# Altium schematic sheet SIM7600G-H_PWR_CTRL.SchDoc
size A; SheetNumber: 20; SheetTotal: 28
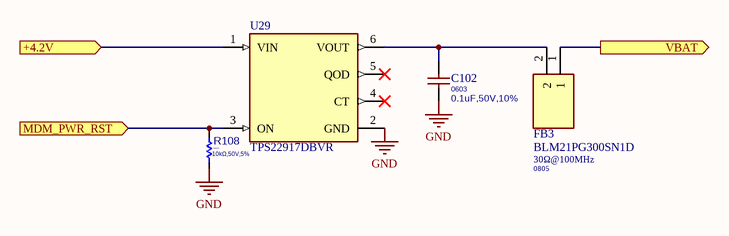
[diagram p0: SIM7600G-H_PWR_CTRL.SchDoc]

## Parts
C102  Package: 0603  [C0603]  (hidden comment: 0.1uF,50V,10%)
FB3  BLM21PG300SN1D  value 30Ω@100MHz  Package: 0805  [BEADC2012X105N]
R108  value 10kΩ,50V,5%  Package: 0402  [R0402]  (hidden comment: 10kΩ)
U29  TPS22917DBVR  [SOT95P280X145-6N]

## Ports
+4.2V (in), MDM_PWR_RST (in), VBAT (out)

## Nets
GND: C102.1 R108.1 U29.2(GND)
+4.2V: U29.1(VIN) ; port +4.2V
MDM_PWR_RST: R108.2 U29.3(ON) ; port MDM_PWR_RST
VBAT: FB3.1 ; port VBAT
NetC102_2: C102.2 FB3.2 U29.6(VOUT)

Not connected (* = marked no-connect by the designer): U29 4(CT)* 5(QOD)*

## Library data of the parts
C102 = GCM188R71H104KA57J: CAP CER 0.1UF 50V X7R 0603; Manufacturer: Murata Electronics; Type: SM; Min Operating Temp: -55°C; Max Operating Temp: 125°C; MPN: GCM188R71H104KA57J; Datasheet: https://datasheet.lcsc.com/lcsc/2404081050_Murata-Electronics-GCM188R71H104KA57J_C3011652.pdf; LCSC: C3011652; Value: 0.1uF,50V,10%
FB3 = BLM21PG300SN1D: Ferrite Bead; Manufacturer: Murata Electronics; Datasheet: https://www.murata.com/en-global/products/productdetail?partno=BLM21PG300SN1%23; MPN: BLM21PG300SN1D; LCSC: C16903
R108 = RC0402JR-0710KL: 62.5mW Thick Film Resistors 50V ±100ppm/℃ ±5% 10kΩ 0402 Chip Resistor - Surface Mount ROHS; Manufacturer: YAGEO; MPN: RC0402JR-0710KL; Max Operating Temp: +155; Min Operating Temp: -55; Datasheet: https://datasheet.lcsc.com/lcsc/1810241334_YAGEO-RC0402JR-0710KL_C60489.pdf; LCSC: C60489
U29 = TPS22917DBVR: 5.5-V, 2-A, 80-mÎ© , 10-nA leakage load switch adj. rise time and adj output discharge; MF: Texas Instruments; SnapEDA_Link: https://www.snapeda.com/parts/TPS22917DBVR/Texas+Instruments/view-part/?ref=snap; Package: SOT-23-6 Texas Instruments; Value: *; MP: TPS22917DBVR; Check_prices: https://www.snapeda.com/parts/TPS22917DBVR/Texas+Instruments/view-part/?ref=eda